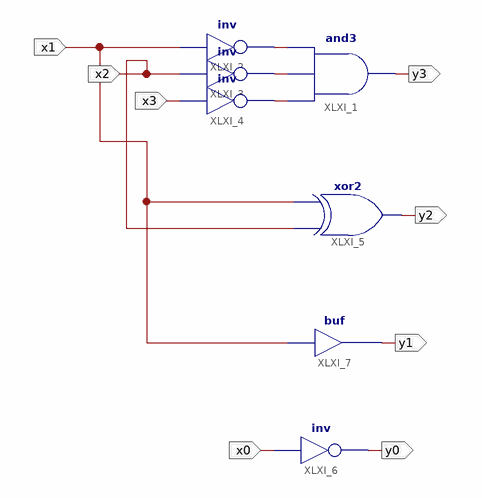
[diagram p0: schematic sheet 1]
// Xilinx ISE schematic Ex3.sch (virtex5) as structural Verilog: 7 symbols, 8 ports
module Ex3 (
  input  x3,
  input  x0,
  input  x1,
  input  x2,
  output y3,
  output y2,
  output y0,
  output y1
);

  wire XLXN_1, XLXN_2, XLXN_3;

  and XLXI_1 (y3, XLXN_3, XLXN_2, XLXN_1);
  not XLXI_2 (XLXN_1, x1);
  not XLXI_3 (XLXN_2, x2);
  not XLXI_4 (XLXN_3, x3);
  xor XLXI_5 (y2, x2, x1);
  not XLXI_6 (y0, x0);
  buf XLXI_7 (y1, x1);
endmodule
